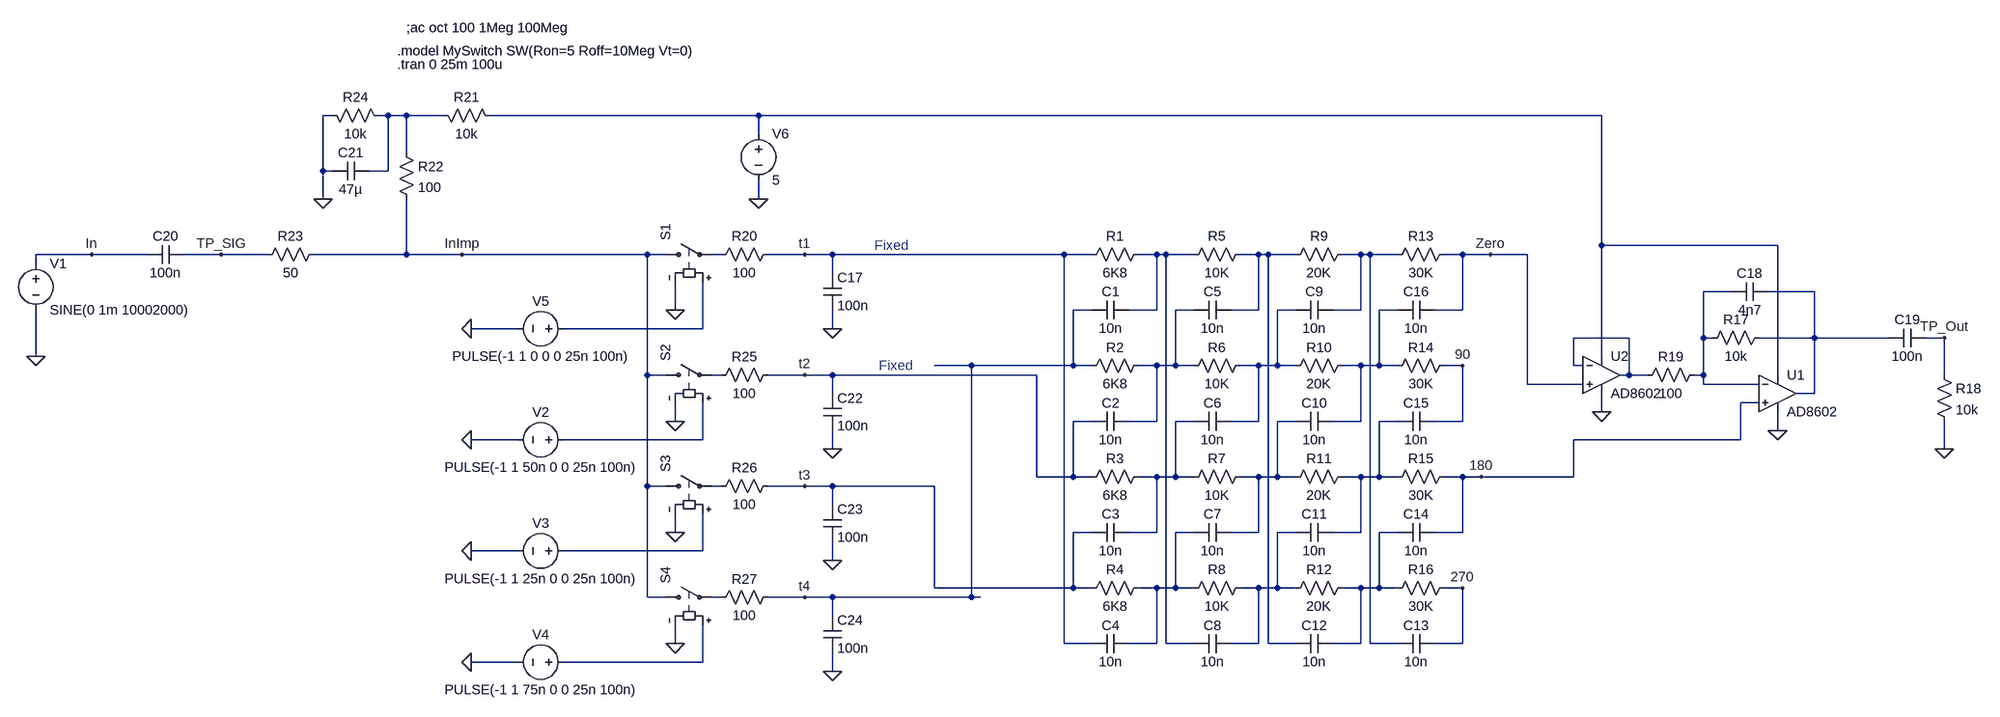
[diagram p0: schematic 4020 QSD 2.asc]
4020 QSD 2.asc, the LTspice schematic file:
Version 4
SHEET 1 2180 1552
WIRE -816 544 -832 544
WIRE -720 544 -736 544
WIRE -688 544 -720 544
WIRE -624 544 -688 544
WIRE -80 544 -544 544
WIRE 1376 544 -80 544
WIRE -80 576 -80 544
WIRE -688 608 -688 544
WIRE -832 640 -832 544
WIRE -816 640 -832 640
WIRE -720 640 -720 544
WIRE -720 640 -752 640
WIRE -832 688 -832 640
WIRE -80 688 -80 656
WIRE 1376 768 1376 544
WIRE 1680 768 1376 768
WIRE -1232 784 -1328 784
WIRE -1136 784 -1232 784
WIRE -1008 784 -1072 784
WIRE -928 784 -1008 784
WIRE -688 784 -688 688
WIRE -688 784 -848 784
WIRE -592 784 -688 784
WIRE -272 784 -592 784
WIRE -240 784 -272 784
WIRE -144 784 -160 784
WIRE 0 784 -64 784
WIRE 48 784 0 784
WIRE 448 784 48 784
WIRE 496 784 448 784
WIRE 608 784 576 784
WIRE 624 784 608 784
WIRE 672 784 624 784
WIRE 784 784 752 784
WIRE 800 784 784 784
WIRE 848 784 800 784
WIRE 960 784 928 784
WIRE 976 784 960 784
WIRE 1024 784 976 784
WIRE 1136 784 1104 784
WIRE 1184 784 1136 784
WIRE 1248 784 1184 784
WIRE -1328 800 -1328 784
WIRE 48 816 48 784
WIRE 1600 848 1552 848
WIRE 1744 848 1664 848
WIRE -224 880 -224 832
WIRE 496 880 464 880
WIRE 608 880 608 784
WIRE 608 880 560 880
WIRE 672 880 640 880
WIRE 784 880 784 784
WIRE 784 880 736 880
WIRE 848 880 816 880
WIRE 960 880 960 784
WIRE 960 880 912 880
WIRE 1024 880 992 880
WIRE 1136 880 1136 784
WIRE 1136 880 1088 880
WIRE -496 912 -576 912
WIRE -176 912 -176 832
WIRE -176 912 -416 912
WIRE 48 912 48 880
WIRE 1424 928 1328 928
WIRE 1552 928 1552 848
WIRE 1568 928 1552 928
WIRE 1744 928 1744 848
WIRE 1744 928 1648 928
WIRE 1872 928 1744 928
WIRE 1968 928 1936 928
WIRE -1328 960 -1328 880
WIRE 1376 960 1376 768
WIRE 288 976 224 976
WIRE 464 976 464 880
WIRE 464 976 288 976
WIRE 496 976 464 976
WIRE 608 976 576 976
WIRE 640 976 640 880
WIRE 640 976 608 976
WIRE 672 976 640 976
WIRE 784 976 752 976
WIRE 816 976 816 880
WIRE 816 976 784 976
WIRE 848 976 816 976
WIRE 960 976 928 976
WIRE 992 976 992 880
WIRE 992 976 960 976
WIRE 1024 976 992 976
WIRE 1136 976 1104 976
WIRE 1328 976 1328 928
WIRE 1344 976 1328 976
WIRE -272 992 -272 784
WIRE -240 992 -272 992
WIRE -144 992 -160 992
WIRE 0 992 -64 992
WIRE 48 992 0 992
WIRE 400 992 48 992
WIRE 1424 992 1424 928
WIRE 1424 992 1408 992
WIRE 1456 992 1424 992
WIRE 1552 992 1552 928
WIRE 1552 992 1536 992
WIRE 1680 992 1680 768
WIRE 1968 992 1968 928
WIRE 1248 1008 1248 784
WIRE 1344 1008 1248 1008
WIRE 1552 1008 1552 992
WIRE 1648 1008 1552 1008
WIRE 48 1024 48 992
WIRE 1744 1024 1744 928
WIRE 1744 1024 1712 1024
WIRE 1648 1040 1616 1040
WIRE 1376 1056 1376 1024
WIRE -224 1072 -224 1040
WIRE 496 1072 464 1072
WIRE 608 1072 608 976
WIRE 608 1072 560 1072
WIRE 672 1072 640 1072
WIRE 784 1072 784 976
WIRE 784 1072 736 1072
WIRE 848 1072 816 1072
WIRE 960 1072 960 976
WIRE 960 1072 912 1072
WIRE 1024 1072 992 1072
WIRE 1136 1072 1136 976
WIRE 1136 1072 1088 1072
WIRE 1680 1088 1680 1056
WIRE -496 1104 -576 1104
WIRE -176 1104 -176 1040
WIRE -176 1104 -416 1104
WIRE 1616 1104 1616 1040
WIRE 1616 1104 1328 1104
WIRE 48 1120 48 1088
WIRE 1968 1120 1968 1072
WIRE 400 1168 400 992
WIRE 464 1168 464 1072
WIRE 464 1168 400 1168
WIRE 496 1168 464 1168
WIRE 608 1168 576 1168
WIRE 640 1168 640 1072
WIRE 640 1168 608 1168
WIRE 672 1168 640 1168
WIRE 784 1168 752 1168
WIRE 816 1168 816 1072
WIRE 816 1168 784 1168
WIRE 848 1168 816 1168
WIRE 960 1168 928 1168
WIRE 992 1168 992 1072
WIRE 992 1168 960 1168
WIRE 1024 1168 992 1168
WIRE 1136 1168 1104 1168
WIRE 1168 1168 1136 1168
WIRE 1328 1168 1328 1104
WIRE 1328 1168 1168 1168
WIRE -272 1184 -272 992
WIRE -240 1184 -272 1184
WIRE -144 1184 -160 1184
WIRE 0 1184 -64 1184
WIRE 48 1184 0 1184
WIRE 224 1184 48 1184
WIRE 48 1216 48 1184
WIRE -224 1264 -224 1232
WIRE 496 1264 464 1264
WIRE 608 1264 608 1168
WIRE 608 1264 560 1264
WIRE 672 1264 640 1264
WIRE 784 1264 784 1168
WIRE 784 1264 736 1264
WIRE 848 1264 816 1264
WIRE 960 1264 960 1168
WIRE 960 1264 912 1264
WIRE 1024 1264 992 1264
WIRE 1136 1264 1136 1168
WIRE 1136 1264 1088 1264
WIRE -496 1296 -576 1296
WIRE -176 1296 -176 1232
WIRE -176 1296 -416 1296
WIRE 48 1312 48 1280
WIRE 224 1360 224 1184
WIRE 464 1360 464 1264
WIRE 464 1360 224 1360
WIRE 496 1360 464 1360
WIRE 608 1360 576 1360
WIRE 640 1360 640 1264
WIRE 640 1360 608 1360
WIRE 672 1360 640 1360
WIRE 784 1360 752 1360
WIRE 816 1360 816 1264
WIRE 816 1360 784 1360
WIRE 848 1360 816 1360
WIRE 960 1360 928 1360
WIRE 992 1360 992 1264
WIRE 992 1360 960 1360
WIRE 1024 1360 992 1360
WIRE 1136 1360 1104 1360
WIRE -272 1376 -272 1184
WIRE -240 1376 -272 1376
WIRE -144 1376 -160 1376
WIRE 0 1376 -64 1376
WIRE 48 1376 0 1376
WIRE 288 1376 288 976
WIRE 288 1376 48 1376
WIRE 304 1376 288 1376
WIRE 48 1408 48 1376
WIRE -224 1456 -224 1424
WIRE 448 1456 448 784
WIRE 496 1456 448 1456
WIRE 608 1456 608 1360
WIRE 608 1456 560 1456
WIRE 624 1456 624 784
WIRE 672 1456 624 1456
WIRE 784 1456 784 1360
WIRE 784 1456 736 1456
WIRE 800 1456 800 784
WIRE 848 1456 800 1456
WIRE 960 1456 960 1360
WIRE 960 1456 912 1456
WIRE 976 1456 976 784
WIRE 1024 1456 976 1456
WIRE 1136 1456 1136 1360
WIRE 1136 1456 1088 1456
WIRE -496 1488 -576 1488
WIRE -176 1488 -176 1424
WIRE -176 1488 -416 1488
WIRE 48 1504 48 1472
FLAG 1184 784 Zero
FLAG 1136 976 90
FLAG 1168 1168 180
FLAG 1136 1360 270
FLAG 1680 1088 0
FLAG 48 912 0
FLAG -224 880 0
FLAG -576 1104 0
FLAG -576 1296 0
FLAG -576 1488 0
FLAG -224 1072 0
FLAG -224 1264 0
FLAG -224 1456 0
FLAG 48 1120 0
FLAG 48 1312 0
FLAG 48 1504 0
FLAG 1968 1120 0
FLAG 1968 928 TP_Out
FLAG -576 912 0
FLAG 0 784 t1
FLAG 0 992 t2
FLAG 0 1184 t3
FLAG 0 1376 t4
FLAG -592 784 InImp
FLAG -80 688 0
FLAG 1376 1056 0
FLAG -1328 960 0
FLAG -1232 784 In
FLAG -1008 784 TP_SIG
FLAG -832 688 0
SYMBOL res 480 800 R270
WINDOW 0 32 56 VTop 2
WINDOW 3 0 56 VBottom 2
SYMATTR InstName R1
SYMATTR Value 6K8
SYMBOL cap 496 896 R270
WINDOW 0 32 32 VTop 2
WINDOW 3 0 32 VBottom 2
SYMATTR InstName C1
SYMATTR Value 10n
SYMBOL cap 496 1088 R270
WINDOW 0 32 32 VTop 2
WINDOW 3 0 32 VBottom 2
SYMATTR InstName C2
SYMATTR Value 10n
SYMBOL cap 496 1280 R270
WINDOW 0 32 32 VTop 2
WINDOW 3 0 32 VBottom 2
SYMATTR InstName C3
SYMATTR Value 10n
SYMBOL cap 496 1472 R270
WINDOW 0 32 32 VTop 2
WINDOW 3 0 32 VBottom 2
SYMATTR InstName C4
SYMATTR Value 10n
SYMBOL res 656 800 R270
WINDOW 0 32 56 VTop 2
WINDOW 3 0 56 VBottom 2
SYMATTR InstName R5
SYMATTR Value 10K
SYMBOL cap 672 896 R270
WINDOW 0 32 32 VTop 2
WINDOW 3 0 32 VBottom 2
SYMATTR InstName C5
SYMATTR Value 10n
SYMBOL cap 672 1088 R270
WINDOW 0 32 32 VTop 2
WINDOW 3 0 32 VBottom 2
SYMATTR InstName C6
SYMATTR Value 10n
SYMBOL cap 672 1280 R270
WINDOW 0 32 32 VTop 2
WINDOW 3 0 32 VBottom 2
SYMATTR InstName C7
SYMATTR Value 10n
SYMBOL cap 672 1472 R270
WINDOW 0 32 32 VTop 2
WINDOW 3 0 32 VBottom 2
SYMATTR InstName C8
SYMATTR Value 10n
SYMBOL res 832 800 R270
WINDOW 0 32 56 VTop 2
WINDOW 3 0 56 VBottom 2
SYMATTR InstName R9
SYMATTR Value 20K
SYMBOL res 1008 800 R270
WINDOW 0 32 56 VTop 2
WINDOW 3 0 56 VBottom 2
SYMATTR InstName R13
SYMATTR Value 30K
SYMBOL res 1552 944 R270
WINDOW 0 32 56 VTop 2
WINDOW 3 0 56 VBottom 2
SYMATTR InstName R17
SYMATTR Value 10k
SYMBOL voltage -1328 784 R0
WINDOW 39 24 124 Left 2
SYMATTR Value2 AC 1
SYMATTR InstName V1
SYMATTR Value SINE(0 1m 10002000)
SYMBOL sw -256 784 R270
SYMATTR InstName S1
SYMATTR Value ""
SYMATTR SpiceModel MySwitch
SYMBOL cap 32 816 R0
SYMATTR InstName C17
SYMATTR Value 100n
SYMBOL sw -256 992 R270
SYMATTR InstName S2
SYMATTR Value ""
SYMATTR SpiceModel MySwitch
SYMBOL sw -256 1184 R270
SYMATTR InstName S3
SYMATTR Value ""
SYMATTR SpiceModel MySwitch
SYMBOL sw -256 1376 R270
SYMATTR InstName S4
SYMATTR Value ""
SYMATTR SpiceModel MySwitch
SYMBOL voltage -400 1104 R90
WINDOW 0 -32 56 VBottom 2
WINDOW 3 32 56 VTop 2
WINDOW 123 32 56 VTop 2
WINDOW 39 32 56 VTop 2
SYMATTR InstName V2
SYMATTR Value PULSE(-1 1 50n 0 0 25n 100n)
SYMBOL voltage -400 1296 R90
WINDOW 0 -32 56 VBottom 2
WINDOW 3 32 56 VTop 2
WINDOW 123 32 56 VTop 2
WINDOW 39 32 56 VTop 2
SYMATTR InstName V3
SYMATTR Value PULSE(-1 1 25n 0 0 25n 100n)
SYMBOL voltage -400 1488 R90
WINDOW 0 -32 56 VBottom 2
WINDOW 3 32 56 VTop 2
WINDOW 123 32 56 VTop 2
WINDOW 39 32 56 VTop 2
SYMATTR InstName V4
SYMATTR Value PULSE(-1 1 75n 0 0 25n 100n)
SYMBOL cap 1664 832 R90
WINDOW 0 0 32 VBottom 2
WINDOW 3 32 32 VTop 2
SYMATTR InstName C18
SYMATTR Value 4n7
SYMBOL cap 1872 944 R270
WINDOW 0 32 32 VTop 2
WINDOW 3 0 32 VBottom 2
SYMATTR InstName C19
SYMATTR Value 100n
SYMBOL res 1952 976 R0
SYMATTR InstName R18
SYMATTR Value 10k
SYMBOL voltage -400 912 R90
WINDOW 0 -32 56 VBottom 2
WINDOW 3 32 56 VTop 2
WINDOW 123 32 56 VTop 2
WINDOW 39 32 56 VTop 2
SYMATTR InstName V5
SYMATTR Value PULSE(-1 1 0 0 0 25n 100n)
SYMBOL Opamps\\AD8602 1680 960 R0
SYMATTR InstName U1
SYMBOL voltage -80 560 R0
WINDOW 123 0 0 Left 2
WINDOW 39 0 0 Left 2
SYMATTR InstName V6
SYMATTR Value 5
SYMBOL Opamps\\AD8602 1376 928 R0
SYMATTR InstName U2
SYMBOL res 1440 1008 R270
WINDOW 0 32 56 VTop 2
WINDOW 3 0 56 VBottom 2
SYMATTR InstName R19
SYMATTR Value 100
SYMBOL cap -1136 800 R270
WINDOW 0 32 32 VTop 2
WINDOW 3 0 32 VBottom 2
SYMATTR InstName C20
SYMATTR Value 100n
SYMBOL res -48 768 R90
WINDOW 0 0 56 VBottom 2
WINDOW 3 32 56 VTop 2
SYMATTR InstName R20
SYMATTR Value 100
SYMBOL res -528 560 M270
WINDOW 0 32 56 VTop 2
WINDOW 3 0 56 VBottom 2
SYMATTR InstName R21
SYMATTR Value 10k
SYMBOL res -704 592 R0
SYMATTR InstName R22
SYMATTR Value 100
SYMBOL res -832 768 R90
WINDOW 0 0 56 VBottom 2
WINDOW 3 32 56 VTop 2
SYMATTR InstName R23
SYMATTR Value 50
SYMBOL res -720 560 M270
WINDOW 0 32 56 VTop 2
WINDOW 3 0 56 VBottom 2
SYMATTR InstName R24
SYMATTR Value 10k
SYMBOL cap -816 656 R270
WINDOW 0 32 32 VTop 2
WINDOW 3 0 32 VBottom 2
SYMATTR InstName C21
SYMATTR Value 47µ
SYMBOL cap 32 1024 R0
SYMATTR InstName C22
SYMATTR Value 100n
SYMBOL cap 32 1216 R0
SYMATTR InstName C23
SYMATTR Value 100n
SYMBOL cap 32 1408 R0
SYMATTR InstName C24
SYMATTR Value 100n
SYMBOL res -48 976 R90
WINDOW 0 0 56 VBottom 2
WINDOW 3 32 56 VTop 2
SYMATTR InstName R25
SYMATTR Value 100
SYMBOL res -48 1168 R90
WINDOW 0 0 56 VBottom 2
WINDOW 3 32 56 VTop 2
SYMATTR InstName R26
SYMATTR Value 100
SYMBOL res -48 1360 R90
WINDOW 0 0 56 VBottom 2
WINDOW 3 32 56 VTop 2
SYMATTR InstName R27
SYMATTR Value 100
SYMBOL cap 848 896 R270
WINDOW 0 32 32 VTop 2
WINDOW 3 0 32 VBottom 2
SYMATTR InstName C9
SYMATTR Value 10n
SYMBOL cap 848 1088 R270
WINDOW 0 32 32 VTop 2
WINDOW 3 0 32 VBottom 2
SYMATTR InstName C10
SYMATTR Value 10n
SYMBOL cap 848 1280 R270
WINDOW 0 32 32 VTop 2
WINDOW 3 0 32 VBottom 2
SYMATTR InstName C11
SYMATTR Value 10n
SYMBOL cap 848 1472 R270
WINDOW 0 32 32 VTop 2
WINDOW 3 0 32 VBottom 2
SYMATTR InstName C12
SYMATTR Value 10n
SYMBOL cap 1024 1472 R270
WINDOW 0 32 32 VTop 2
WINDOW 3 0 32 VBottom 2
SYMATTR InstName C13
SYMATTR Value 10n
SYMBOL cap 1024 1280 R270
WINDOW 0 32 32 VTop 2
WINDOW 3 0 32 VBottom 2
SYMATTR InstName C14
SYMATTR Value 10n
SYMBOL cap 1024 1088 R270
WINDOW 0 32 32 VTop 2
WINDOW 3 0 32 VBottom 2
SYMATTR InstName C15
SYMATTR Value 10n
SYMBOL cap 1024 896 R270
WINDOW 0 32 32 VTop 2
WINDOW 3 0 32 VBottom 2
SYMATTR InstName C16
SYMATTR Value 10n
SYMBOL res 656 992 R270
WINDOW 0 32 56 VTop 2
WINDOW 3 0 56 VBottom 2
SYMATTR InstName R6
SYMATTR Value 10K
SYMBOL res 656 1184 R270
WINDOW 0 32 56 VTop 2
WINDOW 3 0 56 VBottom 2
SYMATTR InstName R7
SYMATTR Value 10K
SYMBOL res 656 1376 R270
WINDOW 0 32 56 VTop 2
WINDOW 3 0 56 VBottom 2
SYMATTR InstName R8
SYMATTR Value 10K
SYMBOL res 832 992 R270
WINDOW 0 32 56 VTop 2
WINDOW 3 0 56 VBottom 2
SYMATTR InstName R10
SYMATTR Value 20K
SYMBOL res 832 1184 R270
WINDOW 0 32 56 VTop 2
WINDOW 3 0 56 VBottom 2
SYMATTR InstName R11
SYMATTR Value 20K
SYMBOL res 832 1376 R270
WINDOW 0 32 56 VTop 2
WINDOW 3 0 56 VBottom 2
SYMATTR InstName R12
SYMATTR Value 20K
SYMBOL res 1008 992 R270
WINDOW 0 32 56 VTop 2
WINDOW 3 0 56 VBottom 2
SYMATTR InstName R14
SYMATTR Value 30K
SYMBOL res 1008 1184 R270
WINDOW 0 32 56 VTop 2
WINDOW 3 0 56 VBottom 2
SYMATTR InstName R15
SYMATTR Value 30K
SYMBOL res 1008 1376 R270
WINDOW 0 32 56 VTop 2
WINDOW 3 0 56 VBottom 2
SYMATTR InstName R16
SYMATTR Value 30K
SYMBOL res 480 992 R270
WINDOW 0 32 56 VTop 2
WINDOW 3 0 56 VBottom 2
SYMATTR InstName R2
SYMATTR Value 6K8
SYMBOL res 480 1184 R270
WINDOW 0 32 56 VTop 2
WINDOW 3 0 56 VBottom 2
SYMATTR InstName R3
SYMATTR Value 6K8
SYMBOL res 480 1376 R270
WINDOW 0 32 56 VTop 2
WINDOW 3 0 56 VBottom 2
SYMATTR InstName R4
SYMATTR Value 6K8
TEXT -704 456 Left 2 !.tran 0 25m 100u
TEXT -704 432 Left 2 !.model MySwitch SW(Ron=5 Roff=10Meg Vt=0)
TEXT -688 392 Left 2 !;ac oct 100 1Meg 100Meg
TEXT 120 768 Left 2 ;Fixed
TEXT 128 976 Left 2 ;Fixed

The netlist it stands for:
* 4020 QSD 2.asc
R1 t1 N004 6K8
C1 t4 N004 10n
C2 t2 N009 10n
C3 t3 N015 10n
C4 t1 N020 10n
R5 N004 N005 10K
C5 N009 N005 10n
C6 N015 N010 10n
C7 N020 N016 10n
C8 N004 N021 10n
R9 N005 N006 20K
R13 N006 Zero 30K
R17 N007 N008 10k
V1 In 0 SINE(0 1m 10002000) AC 1
S1 InImp N003 N012 0 MySwitch
C17 t1 0 100n
S2 InImp N014 N018 0 MySwitch
S3 InImp N019 N023 0 MySwitch
S4 InImp N024 N025 0 MySwitch
V2 N018 0 PULSE(-1 1 50n 0 0 25n 100n)
V3 N023 0 PULSE(-1 1 25n 0 0 25n 100n)
V4 N025 0 PULSE(-1 1 75n 0 0 25n 100n)
C18 N008 N007 4n7
C19 N008 TP_Out 100n
R18 TP_Out 0 10k
V5 N012 0 PULSE(-1 1 0 0 0 25n 100n)
XU1 180 N007 N002 0 N008 AD8602  ; pins In+ In- V+ V- OUT
V6 N002 0 5
XU2 Zero N013 N002 0 N013 AD8602  ; pins In+ In- V+ V- OUT
R19 N013 N007 100
C20 In TP_SIG 100n
R20 t1 N003 100
R21 N002 N001 10k
R22 N001 InImp 100
R23 InImp TP_SIG 50
R24 N001 0 10k
C21 0 N001 47µ
C22 t2 0 100n
C23 t3 0 100n
C24 t4 0 100n
R25 t2 N014 100
R26 t3 N019 100
R27 t4 N024 100
C9 N010 N006 10n
C10 N016 N011 10n
C11 N021 N017 10n
C12 N005 N022 10n
C13 N006 270 10n
C14 N022 180 10n
C15 N017 90 10n
C16 N011 Zero 10n
R6 N009 N010 10K
R7 N015 N016 10K
R8 N020 N021 10K
R10 N010 N011 20K
R11 N016 N017 20K
R12 N021 N022 20K
R14 N011 90 30K
R15 N017 180 30K
R16 N022 270 30K
R2 t4 N009 6K8
R3 t2 N015 6K8
R4 t3 N020 6K8
.tran 0 25m 100u
.model MySwitch SW(Ron=5 Roff=10Meg Vt=0)
;ac oct 100 1Meg 100Meg
* Fixed
* Fixed
.backanno
.end